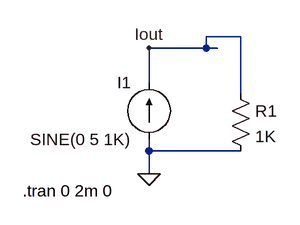
[diagram p0: schematic Draft2.asc]
Draft2.asc, the LTspice schematic file:
Version 4.1
SHEET 1 880 680
WIRE 304 32 256 32
WIRE 256 48 256 32
WIRE 256 48 176 48
WIRE 272 48 256 48
WIRE 176 96 176 48
WIRE 304 112 304 32
WIRE 176 192 176 176
WIRE 304 192 176 192
WIRE 176 224 176 192
FLAG 176 224 0
FLAG 176 48 Iout
SYMBOL current 176 176 R180
WINDOW 0 24 80 Left 2
WINDOW 3 24 0 Left 2
WINDOW 123 0 0 Left 0
WINDOW 39 0 0 Left 0
SYMATTR InstName I1
SYMATTR Value SINE(0 5 1K)
SYMBOL res 288 96 R0
SYMATTR InstName R1
SYMATTR Value 1K
TEXT 0 248 Left 2 !.tran 0 2m 0

The netlist it stands for:
* Draft2.asc
I1 0 Iout SINE(0 5 1K)
R1 Iout 0 1K
.tran 0 2m 0
.backanno
.end

* Results of the author's LTspice run, read from the files saved beside the schematic
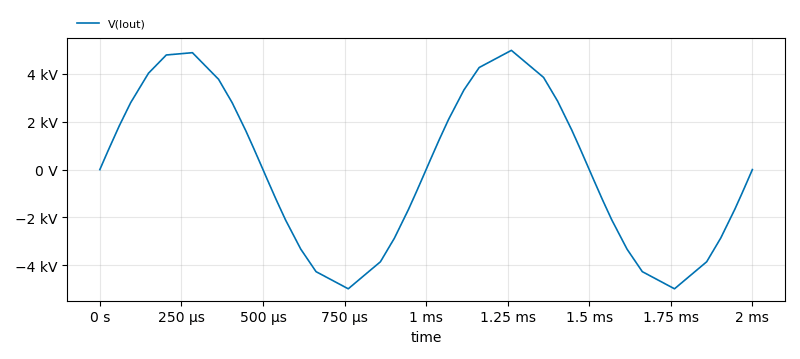
[diagram p1: Transient Analysis of Draft2.asc, plotted from the saved traces]
* Transient Analysis, 1 run:
*   V(Iout): min -4.983 kV, max 4.983 kV, average 5.929 V, rms 3.478 kV, last 0 V